# Altium schematic sheet Hydrophone_preamp_Main_schematic.SchDoc: Wprowadź Tytuł
size A4; CheckedBy: Wprowadź sprawdzającego; CompanyName: Politechnika Warszawska; DrawnBy: Wprowadź autora; Organization: Koło Naukowe Robotyków; Address1: Nowowiejska 24; Address2: 00-001; Address3: Warszawa; Address4: Polska; Revision: V*.*; DrawnDate: 10.10.20; CheckDate: 10.10.20; ProjectName: Nazwa Projektu
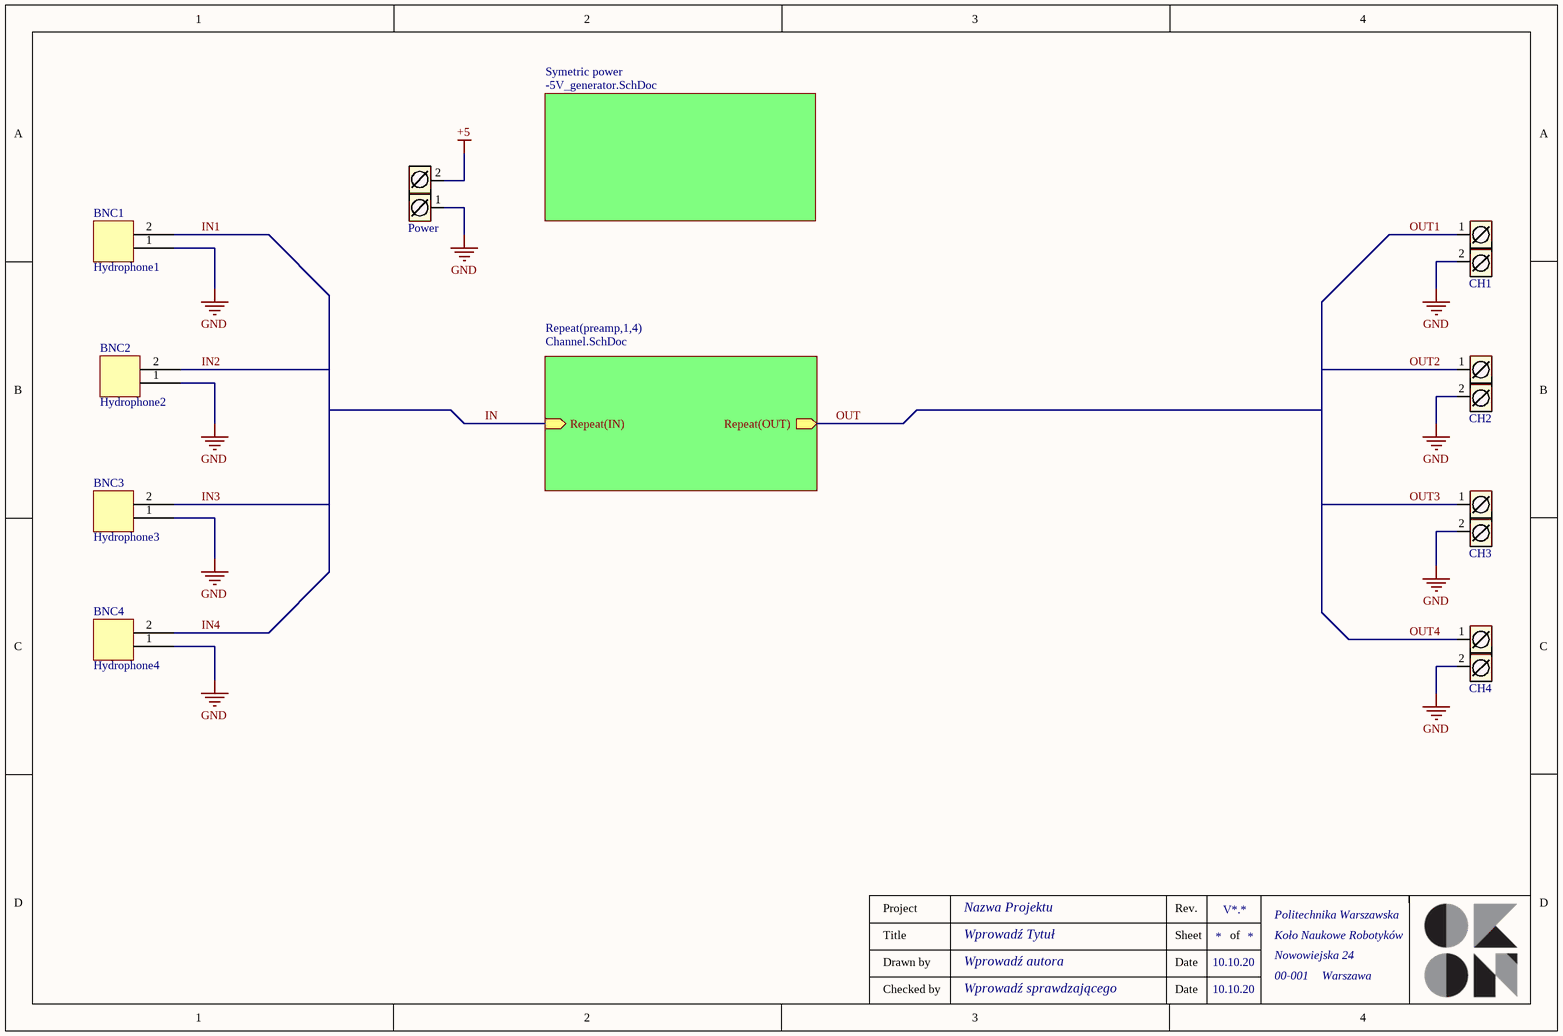
[diagram p0: Hydrophone_preamp_Main_schematic.SchDoc]

## Parts
BNC1  Hydrophone1  [BNC]
BNC2  Hydrophone2  [BNC]
BNC3  Hydrophone3  [BNC]
BNC4  Hydrophone4  [BNC]
CH1  ARK2  [ARK2]  (value not drawn)
CH2  ARK2  [ARK2]  (value not drawn)
CH3  ARK2  [ARK2]  (value not drawn)
CH4  ARK2  [ARK2]  (value not drawn)
Power  ARK2  [ARK2]  (value not drawn)

## Sub-sheets
Repeat(preamp,1,4) = Channel.SchDoc: Repeat(IN) (in), Repeat(OUT) (out)
Symetric power = -5V_generator.SchDoc: no entries

## Nets
+5: Power.2
GND: BNC1.1 BNC2.1 BNC3.1 BNC4.1 CH1.2 CH2.2 CH3.2 CH4.2 Power.1
IN: sheet Repeat(preamp,1,4)/Repeat(IN)
IN1: BNC1.2
IN2: BNC2.2
IN3: BNC3.2
IN4: BNC4.2
OUT: sheet Repeat(preamp,1,4)/Repeat(OUT)
OUT1: CH1.1
OUT2: CH2.1
OUT3: CH3.1
OUT4: CH4.1

## Notes on the sheet
- Project
- Rev.
- Title
- Drawn by
- Date
- Sheet
- of
- Checked by

## Library data of the parts
BNC1-BNC4 = BNC gniazdo: ComponentLink1Description: TME; ComponentLink1URL: https://www.tme.eu/pl/details/5-1634503-1/zlacza-bnc/te-connectivity/; ComponentLink2Description: datasheet; ComponentLink2URL: https://www.tme.eu/Document/98c590ab217976accc479c0d40976d37/5-1634503-1.pdf
CH1-CH4 Power = ARK2: Złącze śrubowe 2 piny